# Altium schematic sheet BOCD_CycloneEPC12.SchDoc: Cyclone EP1C12 Daughterboard
size C; Organization: Altium Limited; Address1: L3, 12a Rodborough Rd; Address2: Frenchs Forest; Address3: NSW; Address4: Australia 2086; Revision: 1.02; SheetNumber: 1; SheetTotal: 1
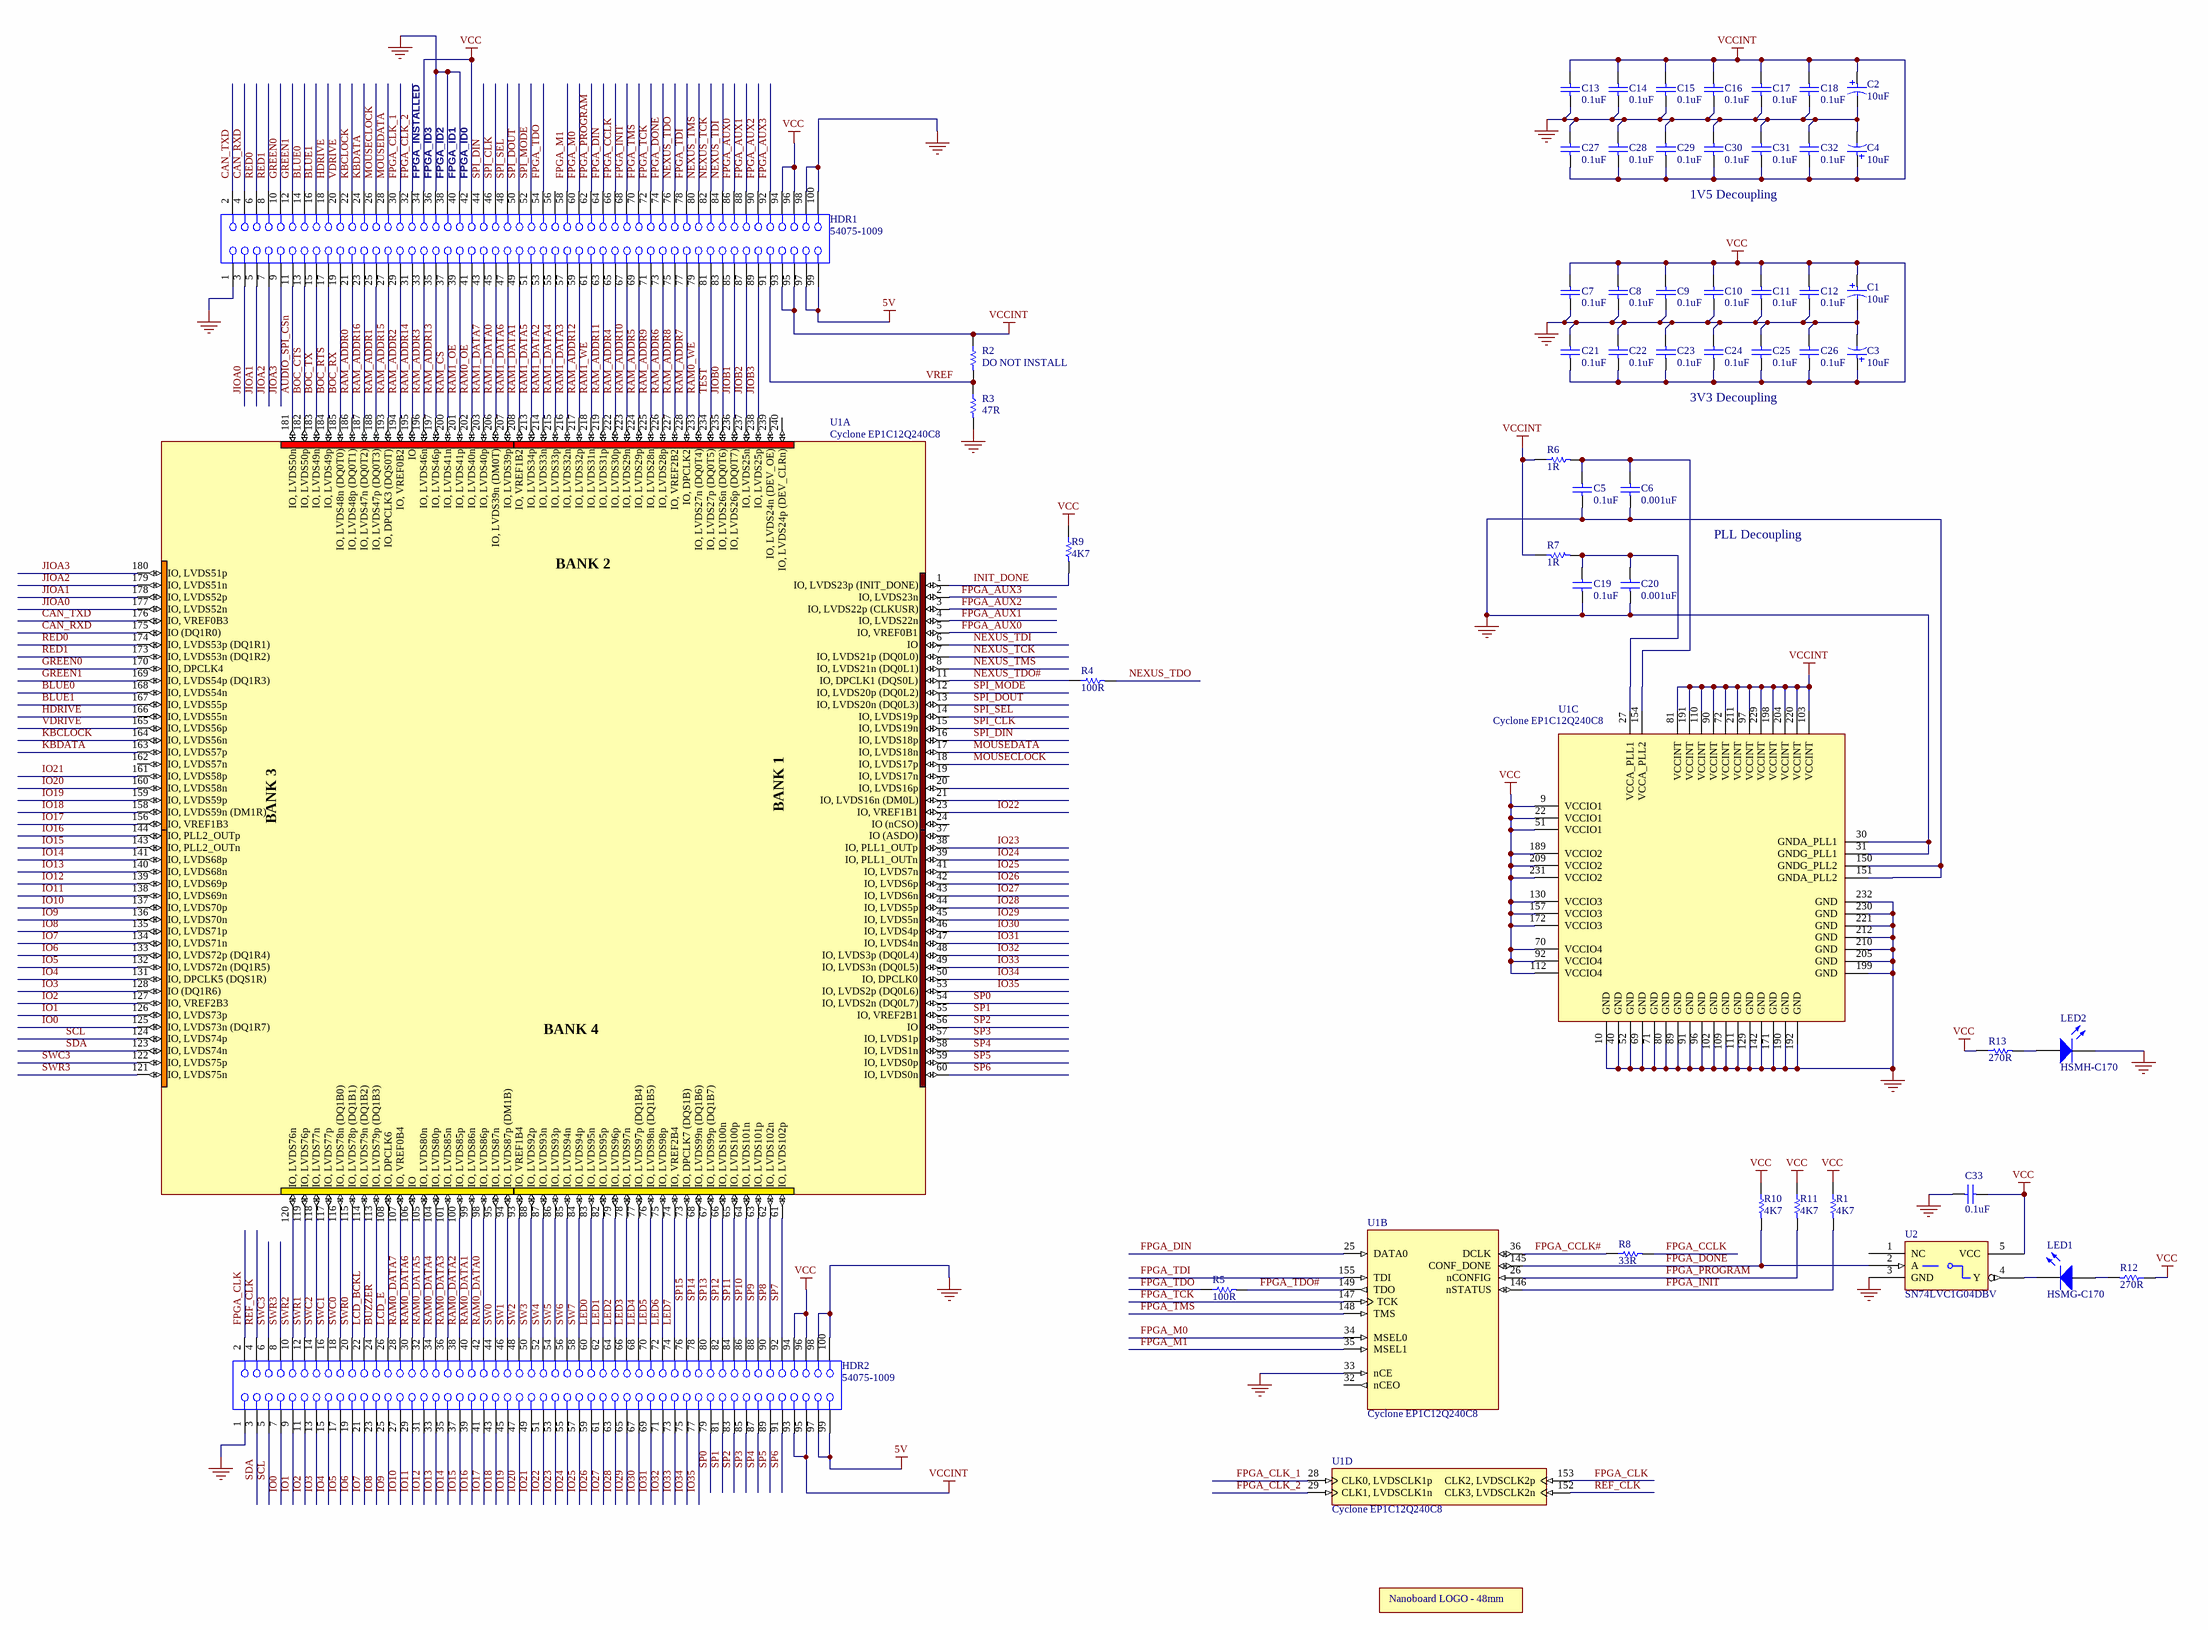
[diagram p0: BOCD_CycloneEPC12.SchDoc]

## Parts
?  NanoboardLogo48mm  [NanoBoard1_LOGO]  (value not drawn)  (graphical)
C1  10uF  [MCCT-B]
C2  10uF  [MCCT-B]
C3  10uF  [MCCT-B]
C4  10uF  [MCCT-B]
C5  0.1uF  [CC2012-0805]
C6  0.001uF  [CC2012-0805]
C7  0.1uF  [CC2012-0805]
C8  0.1uF  [CC2012-0805]
C9  0.1uF  [CC2012-0805]
C10  0.1uF  [CC2012-0805]
C11  0.1uF  [CC2012-0805]
C12  0.1uF  [CC2012-0805]
C13  0.1uF  [CC2012-0805]
C14  0.1uF  [CC2012-0805]
C15  0.1uF  [CC2012-0805]
C16  0.1uF  [CC2012-0805]
C17  0.1uF  [CC2012-0805]
C18  0.1uF  [CC2012-0805]
C19  0.1uF  [CC2012-0805]
C20  0.001uF  [CC2012-0805]
C21  0.1uF  [CC2012-0805]
C22  0.1uF  [CC2012-0805]
C23  0.1uF  [CC2012-0805]
C24  0.1uF  [CC2012-0805]
C25  0.1uF  [CC2012-0805]
C26  0.1uF  [CC2012-0805]
C27  0.1uF  [CC2012-0805]
C28  0.1uF  [CC2012-0805]
C29  0.1uF  [CC2012-0805]
C30  0.1uF  [CC2012-0805]
C31  0.1uF  [CC2012-0805]
C32  0.1uF  [CC2012-0805]
C33  0.1uF  [CC2012-0805]
HDR1  54075-1009  [54075]
HDR2  54075-1009  [54075]
LED1  HSMG-C170  [SMD _LED]
LED2  HSMH-C170  [SMD _LED]
R1  4K7  [CC2012-0805]
R2  DO NOT INSTALL  [CC2012-0805]
R3  47R  [CC2012-0805]
R4  100R  [CC2012-0805]
R5  100R  [CC2012-0805]
R6  1R  [CC2012-0805]
R7  1R  [CC2012-0805]
R8  33R  [CC2012-0805]
R9  4K7  [CC2012-0805]
R10  4K7  [CC2012-0805]
R11  4K7  [CC2012-0805]
R12  270R  [CC2012-0805]
R13  270R  [CC2012-0805]
U1  Cyclone EP1C12Q240C8  [F-QFP32X32-G240/P.5N(RS)]  (parts A,B,C,D of 4)
U2  SN74LVC1G04DBV  [SO-G5/P.95]

## Nets
5V: HDR1.97 HDR1.99 HDR2.97 HDR2.99
GND: C1.2 C2.2 C3.2 C4.2 C5.2 C6.2 C7.2 C8.2 C9.2 C10.2 C11.2 C12.2 C13.2 C14.2 C15.2 C16.2 C17.2 C18.2 C19.1 C20.1 C21.1 C22.1 C23.1 C24.1 C25.1 C26.1 C27.1 C28.1 C29.1 C30.1 C31.1 C32.1 C33.2 HDR1.1 HDR1.36 HDR1.38 HDR1.40 HDR1.98 HDR1.100 HDR2.1 HDR2.98 HDR2.100 LED2.2(K) R3.2 U1.10(GND) U1.30(GNDA_PLL1) U1.31(GNDG_PLL1) U1.33(nCE) U1.40(GND) U1.52(GND) U1.69(GND) U1.71(GND) U1.80(GND) U1.89(GND) U1.91(GND) U1.96(GND) U1.102(GND) U1.109(GND) U1.111(GND) U1.129(GND) U1.142(GND) U1.150(GNDG_PLL2) U1.151(GNDA_PLL2) U1.171(GND) U1.190(GND) U1.192(GND) U1.199(GND) U1.205(GND) U1.210(GND) U1.212(GND) U1.221(GND) U1.230(GND) U1.232(GND) U2.3(GND)
VCC: C1.1 C3.1 C7.1 C8.1 C9.1 C10.1 C11.1 C12.1 C21.2 C22.2 C23.2 C24.2 C25.2 C26.2 C33.1 HDR1.34 HDR1.42 HDR1.94 HDR1.96 HDR2.94 HDR2.96 R1.1 R9.1 R10.1 R11.1 R12.1 R13.1 U1.9(VCCIO1) U1.22(VCCIO1) U1.51(VCCIO1) U1.70(VCCIO4) U1.92(VCCIO4) U1.112(VCCIO4) U1.130(VCCIO3) U1.157(VCCIO3) U1.172(VCCIO3) U1.189(VCCIO2) U1.209(VCCIO2) U1.231(VCCIO2) U2.5(VCC)
VCCINT: C2.1 C4.1 C13.1 C14.1 C15.1 C16.1 C17.1 C18.1 C27.2 C28.2 C29.2 C30.2 C31.2 C32.2 HDR1.93 HDR1.95 HDR2.93 HDR2.95 R2.1 R6.1 R7.1 U1.72(VCCINT) U1.81(VCCINT) U1.90(VCCINT) U1.97(VCCINT) U1.103(VCCINT) U1.110(VCCINT) U1.191(VCCINT) U1.198(VCCINT) U1.204(VCCINT) U1.211(VCCINT) U1.220(VCCINT) U1.229(VCCINT)
AUDIO_SPI_CSn: HDR1.11 U1.181(IO,_LVDS50n)
BLUE0: HDR1.14 U1.168(IO,_LVDS54n)
BLUE1: HDR1.16 U1.167(IO,_LVDS55p)
BOC_CTS: HDR1.13 U1.182(IO,_LVDS50p)
BOC_RTS: HDR1.17 U1.184(IO,_LVDS49p)
BOC_RX: HDR1.19 U1.185(IO,_LVDS48n_(DQ0T0))
BOC_TX: HDR1.15 U1.183(IO,_LVDS49n)
BUZZER: HDR2.24 U1.113(IO,_LVDS79p_(DQ1B3))
CAN_RXD: HDR1.4 U1.175(IO_(DQ1R0))
CAN_TXD: HDR1.2 U1.176(IO,_VREF0B3)
FPGA_AUX0: HDR1.86 U1.5(IO,_VREF0B1)
FPGA_AUX1: HDR1.88 U1.4(IO,_LVDS22n)
FPGA_AUX2: HDR1.90 U1.3(IO,_LVDS22p_(CLKUSR))
FPGA_AUX3: HDR1.92 U1.2(IO,_LVDS23n)
FPGA_CCLK: HDR1.66 R8.2
FPGA_CCLK#: R8.1 U1.36(DCLK)
FPGA_CLK: HDR2.2 U1.153(CLK2,_LVDSCLK2p)
FPGA_CLK_1: HDR1.30 U1.28(CLK0,_LVDSCLK1p)
FPGA_CLK_2: HDR1.32 U1.29(CLK1,_LVDSCLK1n)
FPGA_DIN: HDR1.64 U1.25(DATA0)
FPGA_DONE: HDR1.74 R10.2 U1.145(CONF_DONE) U2.2(A)
FPGA_INIT: HDR1.68 R1.2 U1.146(nSTATUS)
FPGA_M0: HDR1.60 U1.34(MSEL0)
FPGA_M1: HDR1.58 U1.35(MSEL1)
FPGA_PROGRAM: HDR1.62 R11.2 U1.26(nCONFIG)
FPGA_TCK: HDR1.72 U1.147(TCK)
FPGA_TDI: HDR1.78 U1.155(TDI)
FPGA_TDO: HDR1.54 R5.1
FPGA_TDO#: R5.2 U1.149(TDO)
FPGA_TMS: HDR1.70 U1.148(TMS)
GREEN0: HDR1.10 U1.170(IO,_DPCLK4)
GREEN1: HDR1.12 U1.169(IO,_LVDS54p_(DQ1R3))
HDRIVE: HDR1.18 U1.166(IO,_LVDS55n)
INIT_DONE: R9.2 U1.1(IO,_LVDS23p_(INIT_DONE))
IO0: HDR2.7 U1.125(IO,_LVDS73n_(DQ1R7))
IO1: HDR2.9 U1.126(IO,_LVDS73p)
IO2: HDR2.11 U1.127(IO,_VREF2B3)
IO3: HDR2.13 U1.128(IO_(DQ1R6))
IO4: HDR2.15 U1.131(IO,_DPCLK5_(DQS1R))
IO5: HDR2.17 U1.132(IO,_LVDS72n_(DQ1R5))
IO6: HDR2.19 U1.133(IO,_LVDS72p_(DQ1R4))
IO7: HDR2.21 U1.134(IO,_LVDS71n)
IO8: HDR2.23 U1.135(IO,_LVDS71p)
IO9: HDR2.25 U1.136(IO,_LVDS70n)
IO10: HDR2.27 U1.137(IO,_LVDS70p)
IO11: HDR2.29 U1.138(IO,_LVDS69n)
IO12: HDR2.31 U1.139(IO,_LVDS69p)
IO13: HDR2.33 U1.140(IO,_LVDS68n)
IO14: HDR2.35 U1.141(IO,_LVDS68p)
IO15: HDR2.37 U1.143(IO,_PLL2_OUTn)
IO16: HDR2.39 U1.144(IO,_PLL2_OUTp)
IO17: HDR2.41 U1.156(IO,_VREF1B3)
IO18: HDR2.43 U1.158(IO,_LVDS59n_(DM1R))
IO19: HDR2.45 U1.159(IO,_LVDS59p)
IO20: HDR2.47 U1.160(IO,_LVDS58n)
IO21: HDR2.49 U1.161(IO,_LVDS58p)
IO22: HDR2.51 U1.23(IO,_VREF1B1)
IO23: HDR2.53 U1.38(IO,_PLL1_OUTp)
IO24: HDR2.55 U1.39(IO,_PLL1_OUTn)
IO25: HDR2.57 U1.41(IO,_LVDS7n)
IO26: HDR2.59 U1.42(IO,_LVDS6p)
IO27: HDR2.61 U1.43(IO,_LVDS6n)
IO28: HDR2.63 U1.44(IO,_LVDS5p)
IO29: HDR2.65 U1.45(IO,_LVDS5n)
IO30: HDR2.67 U1.46(IO,_LVDS4p)
IO31: HDR2.69 U1.47(IO,_LVDS4n)
IO32: HDR2.71 U1.48(IO,_LVDS3p_(DQ0L4))
IO33: HDR2.73 U1.49(IO,_LVDS3n_(DQ0L5))
IO34: HDR2.75 U1.50(IO,_DPCLK0)
IO35: HDR2.77 U1.53(IO,_LVDS2p_(DQ0L6))
JIOA0: HDR1.3 U1.177(IO,_LVDS52n)
JIOA1: HDR1.5 U1.178(IO,_LVDS52p)
JIOA2: HDR1.7 U1.179(IO,_LVDS51n)
JIOA3: HDR1.9 U1.180(IO,_LVDS51p)
JIOB0: HDR1.83 U1.235(IO,_LVDS26n_(DQ0T6))
JIOB1: HDR1.85 U1.236(IO,_LVDS26p_(DQ0T7))
JIOB2: HDR1.87 U1.237(IO,_LVDS25n)
JIOB3: HDR1.89 U1.238(IO,_LVDS25p)
KBCLOCK: HDR1.22 U1.164(IO,_LVDS56n)
KBDATA: HDR1.24 U1.163(IO,_LVDS57p)
LCD_BCKL: HDR2.22 U1.114(IO,_LVDS79n_(DQ1B2))
LCD_E: HDR2.26 U1.108(IO,_DPCLK6)
LED0: HDR2.60 U1.83(IO,_LVDS95n)
LED1: HDR2.62 U1.82(IO,_LVDS95p)
LED2: HDR2.64 U1.79(IO,_LVDS96p)
LED3: HDR2.66 U1.78(IO,_LVDS97n)
LED4: HDR2.68 U1.77(IO,_LVDS97p_(DQ1B4))
LED5: HDR2.70 U1.76(IO,_LVDS98n_(DQ1B5))
LED6: HDR2.72 U1.75(IO,_LVDS98p)
LED7: HDR2.74 U1.74(IO,_VREF2B4)
MOUSECLOCK: HDR1.26 U1.18(IO,_LVDS17p)
MOUSEDATA: HDR1.28 U1.17(IO,_LVDS18n)
NEXUS_TCK: HDR1.82 U1.7(IO,_LVDS21p_(DQ0L0))
NEXUS_TDI: HDR1.84 U1.6(IO)
NEXUS_TDO: HDR1.76 R4.2
NEXUS_TDO#: R4.1 U1.11(IO,_DPCLK1_(DQS0L))
NEXUS_TMS: HDR1.80 U1.8(IO,_LVDS21n_(DQ0L1))
RAM0_DATA0: HDR2.42 U1.98(IO,_LVDS86p)
RAM0_DATA1: HDR2.40 U1.99(IO,_LVDS86n)
RAM0_DATA2: HDR2.38 U1.100(IO,_LVDS85p)
RAM0_DATA3: HDR2.36 U1.101(IO,_LVDS85n)
RAM0_DATA4: HDR2.34 U1.104(IO,_LVDS80p)
RAM0_DATA5: HDR2.32 U1.105(IO,_LVDS80n)
RAM0_DATA6: HDR2.30 U1.106(IO)
RAM0_DATA7: HDR2.28 U1.107(IO,_VREF0B4)
RAM0_OE: HDR1.41 U1.202(IO,_LVDS40n)
RAM0_WE: HDR1.79 U1.233(IO,_LVDS27n_(DQ0T4))
RAM1_DATA0: HDR1.45 U1.206(IO,_LVDS39n_(DM0T))
RAM1_DATA1: HDR1.49 U1.208(IO,_VREF1B2)
RAM1_DATA2: HDR1.53 U1.214(IO,_LVDS33n)
RAM1_DATA3: HDR1.57 U1.216(IO,_LVDS32n)
RAM1_DATA4: HDR1.55 U1.215(IO,_LVDS33p)
RAM1_DATA5: HDR1.51 U1.213(IO,_LVDS34p)
RAM1_DATA6: HDR1.47 U1.207(IO,_LVDS39p)
RAM1_DATA7: HDR1.43 U1.203(IO,_LVDS40p)
RAM1_OE: HDR1.39 U1.201(IO,_LVDS41p)
RAM1_WE: HDR1.61 U1.218(IO,_LVDS31n)
RAM_ADDR0: HDR1.21 U1.186(IO,_LVDS48p_(DQ0T1))
RAM_ADDR1: HDR1.25 U1.188(IO,_LVDS47p_(DQ0T3))
RAM_ADDR2: HDR1.29 U1.194(IO,_VREF0B2)
RAM_ADDR3: HDR1.33 U1.196(IO,_LVDS46n)
RAM_ADDR4: HDR1.65 U1.222(IO,_LVDS30p)
RAM_ADDR5: HDR1.69 U1.224(IO,_LVDS29p)
RAM_ADDR6: HDR1.73 U1.226(IO,_LVDS28p)
RAM_ADDR7: HDR1.77 U1.228(IO,_DPCLK2)
RAM_ADDR8: HDR1.75 U1.227(IO,_VREF2B2)
RAM_ADDR9: HDR1.71 U1.225(IO,_LVDS28n)
RAM_ADDR10: HDR1.67 U1.223(IO,_LVDS29n)
RAM_ADDR11: HDR1.63 U1.219(IO,_LVDS31p)
RAM_ADDR12: HDR1.59 U1.217(IO,_LVDS32p)
RAM_ADDR13: HDR1.35 U1.197(IO,_LVDS46p)
RAM_ADDR14: HDR1.31 U1.195(IO)
RAM_ADDR15: HDR1.27 U1.193(IO,_DPCLK3_(DQS0T))
RAM_ADDR16: HDR1.23 U1.187(IO,_LVDS47n_(DQ0T2))
RAM_CS: HDR1.37 U1.200(IO,_LVDS41n)
RED0: HDR1.6 U1.174(IO,_LVDS53p_(DQ1R1))
RED1: HDR1.8 U1.173(IO,_LVDS53n_(DQ1R2))
REF_CLK: HDR2.4 U1.152(CLK3,_LVDSCLK2n)
SCL: HDR2.5 U1.124(IO,_LVDS74p)
SDA: HDR2.3 U1.123(IO,_LVDS74n)
SP0: HDR2.79 U1.54(IO,_LVDS2n_(DQ0L7))
SP1: HDR2.81 U1.55(IO,_VREF2B1)
SP2: HDR2.83 U1.56(IO)
SP3: HDR2.85 U1.57(IO,_LVDS1p)
SP4: HDR2.87 U1.58(IO,_LVDS1n)
SP5: HDR2.89 U1.59(IO,_LVDS0p)
SP6: HDR2.91 U1.60(IO,_LVDS0n)
SP7: HDR2.92 U1.61(IO,_LVDS102p)
SP8: HDR2.90 U1.62(IO,_LVDS102n)
SP9: HDR2.88 U1.63(IO,_LVDS101p)
SP10: HDR2.86 U1.64(IO,_LVDS101n)
SP11: HDR2.84 U1.65(IO,_LVDS100p)
SP12: HDR2.82 U1.66(IO,_LVDS100n)
SP13: HDR2.80 U1.67(IO,_LVDS99p_(DQ1B7))
SP14: HDR2.78 U1.68(IO,_LVDS99n_(DQ1B6))
SP15: HDR2.76 U1.73(IO,_DPCLK7_(DQS1B))
SPI_CLK: HDR1.46 U1.15(IO,_LVDS19n)
SPI_DIN: HDR1.44 U1.16(IO,_LVDS18p)
SPI_DOUT: HDR1.50 U1.13(IO,_LVDS20n_(DQ0L3))
SPI_MODE: HDR1.52 U1.12(IO,_LVDS20p_(DQ0L2))
SPI_SEL: HDR1.48 U1.14(IO,_LVDS19p)
SW0: HDR2.44 U1.95(IO,_LVDS87n)
SW1: HDR2.46 U1.94(IO,_LVDS87p_(DM1B))
SW2: HDR2.48 U1.93(IO,_VREF1B4)
SW3: HDR2.50 U1.88(IO,_LVDS92p)
SW4: HDR2.52 U1.87(IO,_LVDS93n)
SW5: HDR2.54 U1.86(IO,_LVDS93p)
SW6: HDR2.56 U1.85(IO,_LVDS94n)
SW7: HDR2.58 U1.84(IO,_LVDS94p)
SWC0: HDR2.18 U1.116(IO,_LVDS78n_(DQ1B0))
SWC1: HDR2.16 U1.117(IO,_LVDS77p)
SWC2: HDR2.14 U1.118(IO,_LVDS77n)
SWC3: HDR2.6 U1.122(IO,_LVDS75p)
SWR0: HDR2.20 U1.115(IO,_LVDS78p_(DQ1B1))
SWR1: HDR2.12 U1.119(IO,_LVDS76p)
SWR2: HDR2.10 U1.120(IO,_LVDS76n)
SWR3: HDR2.8 U1.121(IO,_LVDS75n)
TEST: HDR1.81 U1.234(IO,_LVDS27p_(DQ0T5))
VDRIVE: HDR1.20 U1.165(IO,_LVDS56p)
VREF: HDR1.91 R2.2 R3.1
NetC5_1: C5.1 C6.1 R6.2 U1.154(VCCA_PLL2)
NetC19_2: C19.2 C20.2 R7.2 U1.27(VCCA_PLL1)
NetLED1_1: LED1.1(A) R12.2
NetLED1_2: LED1.2(K) U2.4(Y)
NetLED2_1: LED2.1(A) R13.2

Not connected (* = marked no-connect by the designer): HDR1 56; U1 19(IO,_LVDS17n) 20(IO,_LVDS16p) 21(IO,_LVDS16n_(DM0L)) 24(IO_(nCSO)) 32(nCEO) 37(IO_(ASDO)) 162(IO,_LVDS57n) 239(IO,_LVDS24n_(DEV_OE)) 240(IO,_LVDS24p_(DEV_CLRn)); U2 1(NC)

## Notes on the sheet
- (near HDR1) FPGA_INSTALLED
- (near HDR1) FPGA_ID3
- (near HDR1) FPGA_ID2
- (near HDR1) FPGA_ID1
- (near HDR1) FPGA_ID0
- 1V5 Decoupling
- 3V3 Decoupling
- PLL Decoupling
- Title
- Size:
- Date:
- File:
- C
- Number:
- Time:
- Revision:
- Sheet
- of
- (in symbol EP1C12Q240C6_ALT, part A) BANK 2; BANK 1; BANK 3; BANK 4
- (in symbol NanoboardLogo48mm) Nanoboard LOGO - 48mm

## Library data of the parts
C1-C4 = CAP_POLAR: Polar Capacitor
  C2-C4: Supplier: FARNELL; Supplier Code: 967-117
C5-C33 = CAP: Capacitor
HDR1 HDR2 = 54075-1009: Board-to-Board, Docking Station, 0.80mm (.031") Pitch, Shielded Receptacle, Vertical, Ultra Low Profile, SMT; Manufacturer: Molex; Package Information: Latest Revision: Jun-2001; Mating Height: 8.5mm; Voltage: 100V; Current: 0.5A; Contact Resistance: 40mOhm max; PCB Layout: Complies with Manufacturer's Recommendation.; Published: 15-Oct-2003; Datasheet: Latest Revision: Feb-2002; Package Reference: 54075; Publisher: Altium Limited
LED1 LED2 = HSMX-C670: Typical RED GaAs SMD LED Agilent make; Manufacturer: Generic Components; Class I: Optoelectronic; Fitted: True; Published: 8-Jun-2000; Revision: July-2002: Re-released for DXP Platform.; Publisher: Altium Limited; Class II: LED
R1-R13 = RES: Resistor
U1 = EP1C12Q240C6_ALT: Cyclone Family, 1.5V FPGA, 173 I/O Pins, 2 x PLLs, Commercial Grade, Speed Grade 6; Manufacturer: Altera; Package Information: Latest Revision: ver11.0, Feb-2003; Class I: Field Programmable Gate Array; Published: 25-Jun-2003; Datasheet: Latest Revision: ver1.0, May-2003; Package Reference: PQFP240; Publisher: Altium Limited; Class II: Cyclone
U2 = SN74AHC1G04DBVR: Manufacturer: TI; Fitted: True